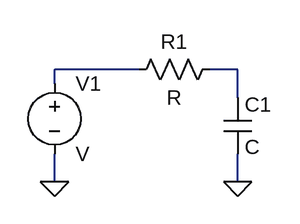
[diagram p0: schematic RC_circuit.asc]
RC_circuit.asc, the LTspice schematic file:
Version 4
SHEET 1 880 680
WIRE 128 96 32 96
WIRE 240 96 208 96
WIRE 32 112 32 96
WIRE 240 128 240 96
WIRE 32 224 32 192
WIRE 240 224 240 192
FLAG 32 224 0
FLAG 240 224 0
SYMBOL res 224 80 R90
WINDOW 0 0 56 VBottom 2
WINDOW 3 32 56 VTop 2
SYMATTR InstName R1
SYMBOL cap 224 128 R0
SYMATTR InstName C1
SYMBOL voltage 32 96 R0
SYMATTR InstName V1

The netlist it stands for:
* RC_circuit.asc
R1 N002 N001 R
C1 N002 0 C
V1 N001 0 V
.backanno
.end